# EAGLE schematic untitled 2 (EAGLE 7.4.0)
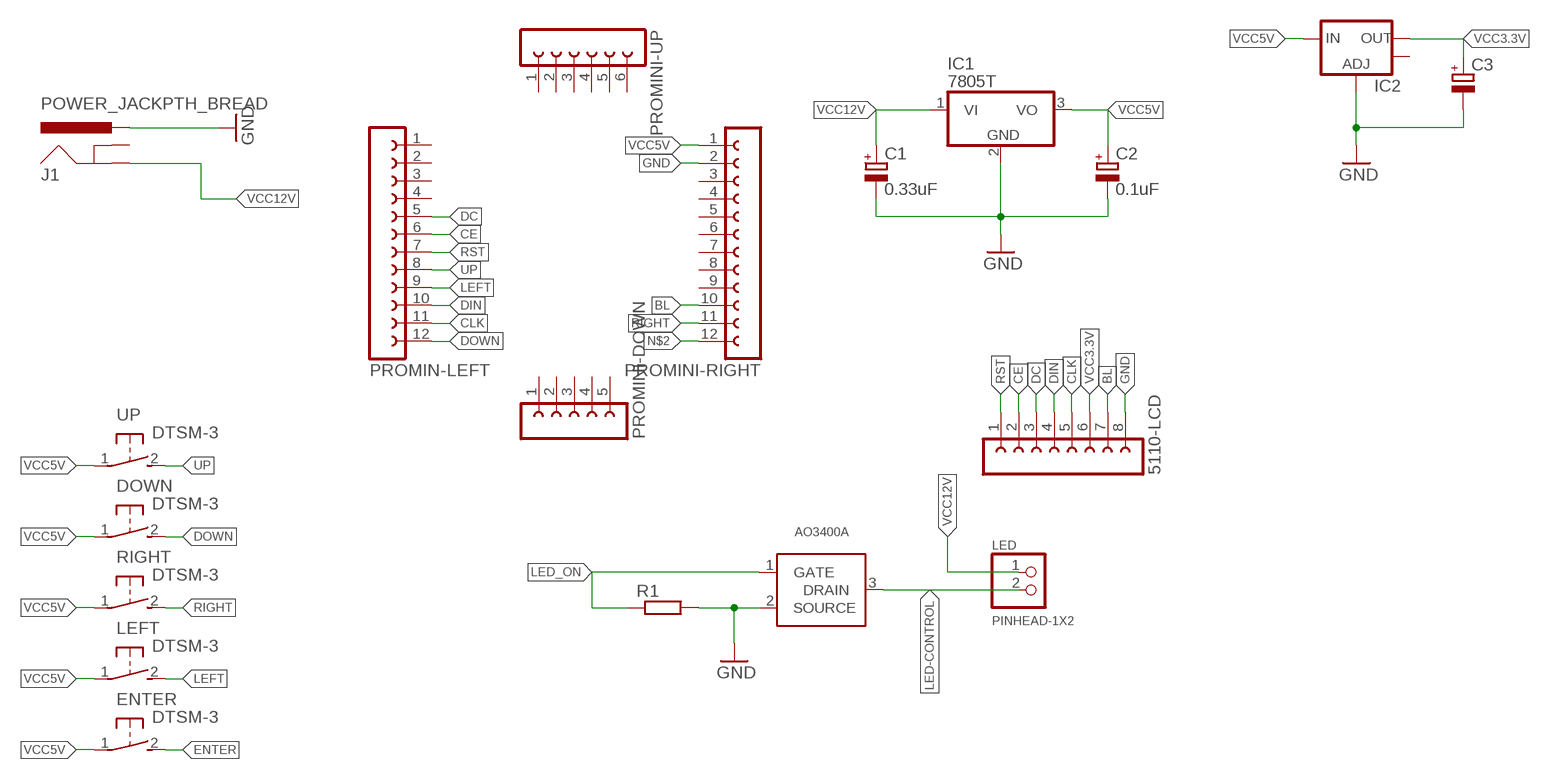
[diagram p0: schematic, sheet 1]

## Parts
5110-LCD  FE08-1  [FE08]
C1  0.33uF  CPOL-EUE1.8-4  [E1,8-4]
C2  0.1uF  CPOL-EUE1.8-4  [E1,8-4]
C3  CPOL-EUE1.8-4  [E1,8-4]
DOWN  DTSM-3  [DTSM-3]
ENTER  DTSM-3  [DTSM-3]
IC1  7805T  [TO220H]
IC2  V_REG_LM1117SOT223  [SOT223]
J1  POWER_JACKPTH_BREAD  [POWER_JACK_PTH_BREAD]
LED  PINHEAD-1X2  [PIHEAD-1X2]
LEFT  DTSM-3  [DTSM-3]
PROMIN-LEFT  FE12-1  [FE12]
PROMINI-DOWN  FE05-1  [FE05-1]
PROMINI-RIGHT  FE12-1  [FE12]
PROMINI-UP  FE06-1  [FE06]
R1  R-EU_R1206  [R1206]
RIGHT  DTSM-3  [DTSM-3]
U$1  AO3400A  [SOT-23]
UP  DTSM-3  [DTSM-3]

## Nets
BL: 5110-LCD.7 PROMINI-RIGHT.10
CE: 5110-LCD.2 PROMIN-LEFT.6
CLK: 5110-LCD.5 PROMIN-LEFT.11
DC: 5110-LCD.3 PROMIN-LEFT.5
DIN: 5110-LCD.4 PROMIN-LEFT.10
DOWN: DOWN.2 PROMIN-LEFT.12
ENTER: ENTER.2
GND: 5110-LCD.8 C1.- C2.- C3.- IC1.2(GND) IC2.1(ADJ) J1.PWR PROMINI-RIGHT.2 R1.2 U$1.2(SOURCE)
LED-CONTROL: LED.2 U$1.3(DRAIN)
LED_ON: R1.1 U$1.1(GATE)
LEFT: LEFT.2 PROMIN-LEFT.9
N$2: PROMINI-RIGHT.12
RIGHT: PROMINI-RIGHT.11 RIGHT.2
RST: 5110-LCD.1 PROMIN-LEFT.7
UP: PROMIN-LEFT.8 UP.2
VCC3.3V: 5110-LCD.6 C3.+ IC2.2(OUT)
VCC5V: C2.+ DOWN.1 ENTER.1 IC1.3(VO) IC2.3(IN) LEFT.1 PROMINI-RIGHT.1 RIGHT.1 UP.1
VCC12V: C1.+ IC1.1(VI) J1.GND LED.1
Unconnected: IC2.4(OUT) J1.GNDBREAK PROMIN-LEFT.1 PROMIN-LEFT.2 PROMIN-LEFT.3 PROMIN-LEFT.4 PROMINI-DOWN.1 PROMINI-DOWN.2 PROMINI-DOWN.3 PROMINI-DOWN.4 PROMINI-DOWN.5 PROMINI-RIGHT.3 PROMINI-RIGHT.4 PROMINI-RIGHT.5 PROMINI-RIGHT.6 PROMINI-RIGHT.7 PROMINI-RIGHT.8 PROMINI-RIGHT.9 PROMINI-UP.1 PROMINI-UP.2 PROMINI-UP.3 PROMINI-UP.4 PROMINI-UP.5 PROMINI-UP.6

## Library data of the parts
5110-LCD = con-lsta:FE08-1: FEMALE HEADER; OC_FARNELL: unknown; OC_NEWARK: unknown
C1-C3 = resistor:CPOL-EU: POLARIZED CAPACITOR, European symbol
DOWN ENTER LEFT RIGHT UP = switch-tact:DTSM-3
IC1 = linear:78*: Positive VOLTAGE REGULATOR Source: http://cache.national.com/ds/LM/LM78L05.pdf http://www.fairchildsemi.com/ds/LM/LM7805.pdf
IC2 = SparkFun-PowerIC:V_REG_LM1117: Voltage Regulator LM1117 Standard adjustable voltage regulator but in SMD form. Spark Fun Electronics SKU : COM-00595; PROD_ID: VREG-08170
J1 = SparkFun-Connectors:POWER_JACK: Power Jack This is the standard 5.5mm barrel jack for power. The PTH is the most common, proven, reliable, footprint. The Slot footprint only works if the mill layer is transmitted to the PCB fab house so be warned. Mating wall wart : TOL-00298 (and others); PROD_ID: PRT-10811
LED = mcp73831:PINHEAD-1X2
PROMIN-LEFT PROMINI-RIGHT = con-lsta:FE12-1: FEMALE HEADER; OC_FARNELL: unknown; OC_NEWARK: unknown
PROMINI-DOWN = con-lsta:FE05-1: FEMALE HEADER; OC_FARNELL: unknown; OC_NEWARK: unknown
PROMINI-UP = con-lsta:FE06-1: FEMALE HEADER; OC_FARNELL: unknown; OC_NEWARK: unknown
R1 = resistor:R-EU_: RESISTOR, European symbol
U$1 = smd-footprints:AO3400A